# EAGLE schematic Mk3 Prototype (EAGLE 6.5.0)
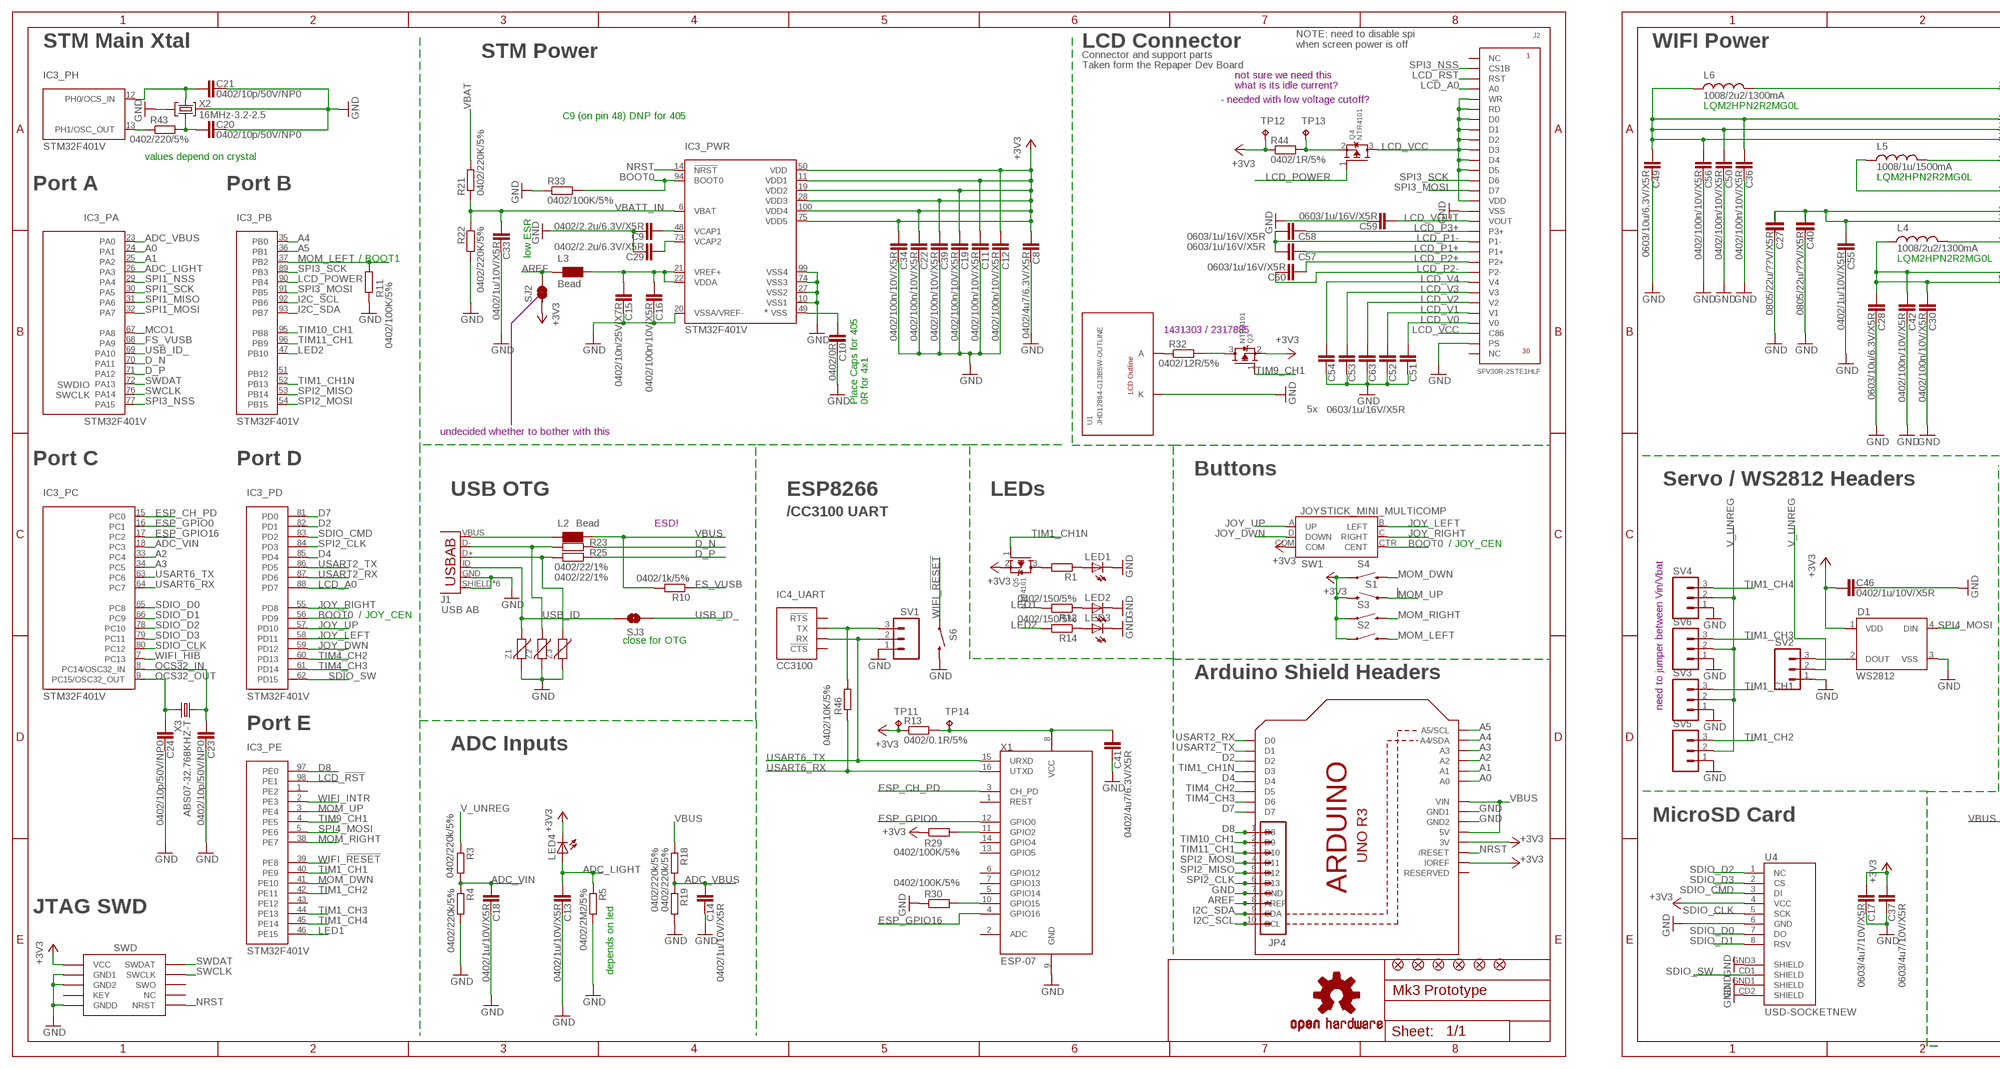
[diagram p0: schematic, sheet 1, part 1 of 2]
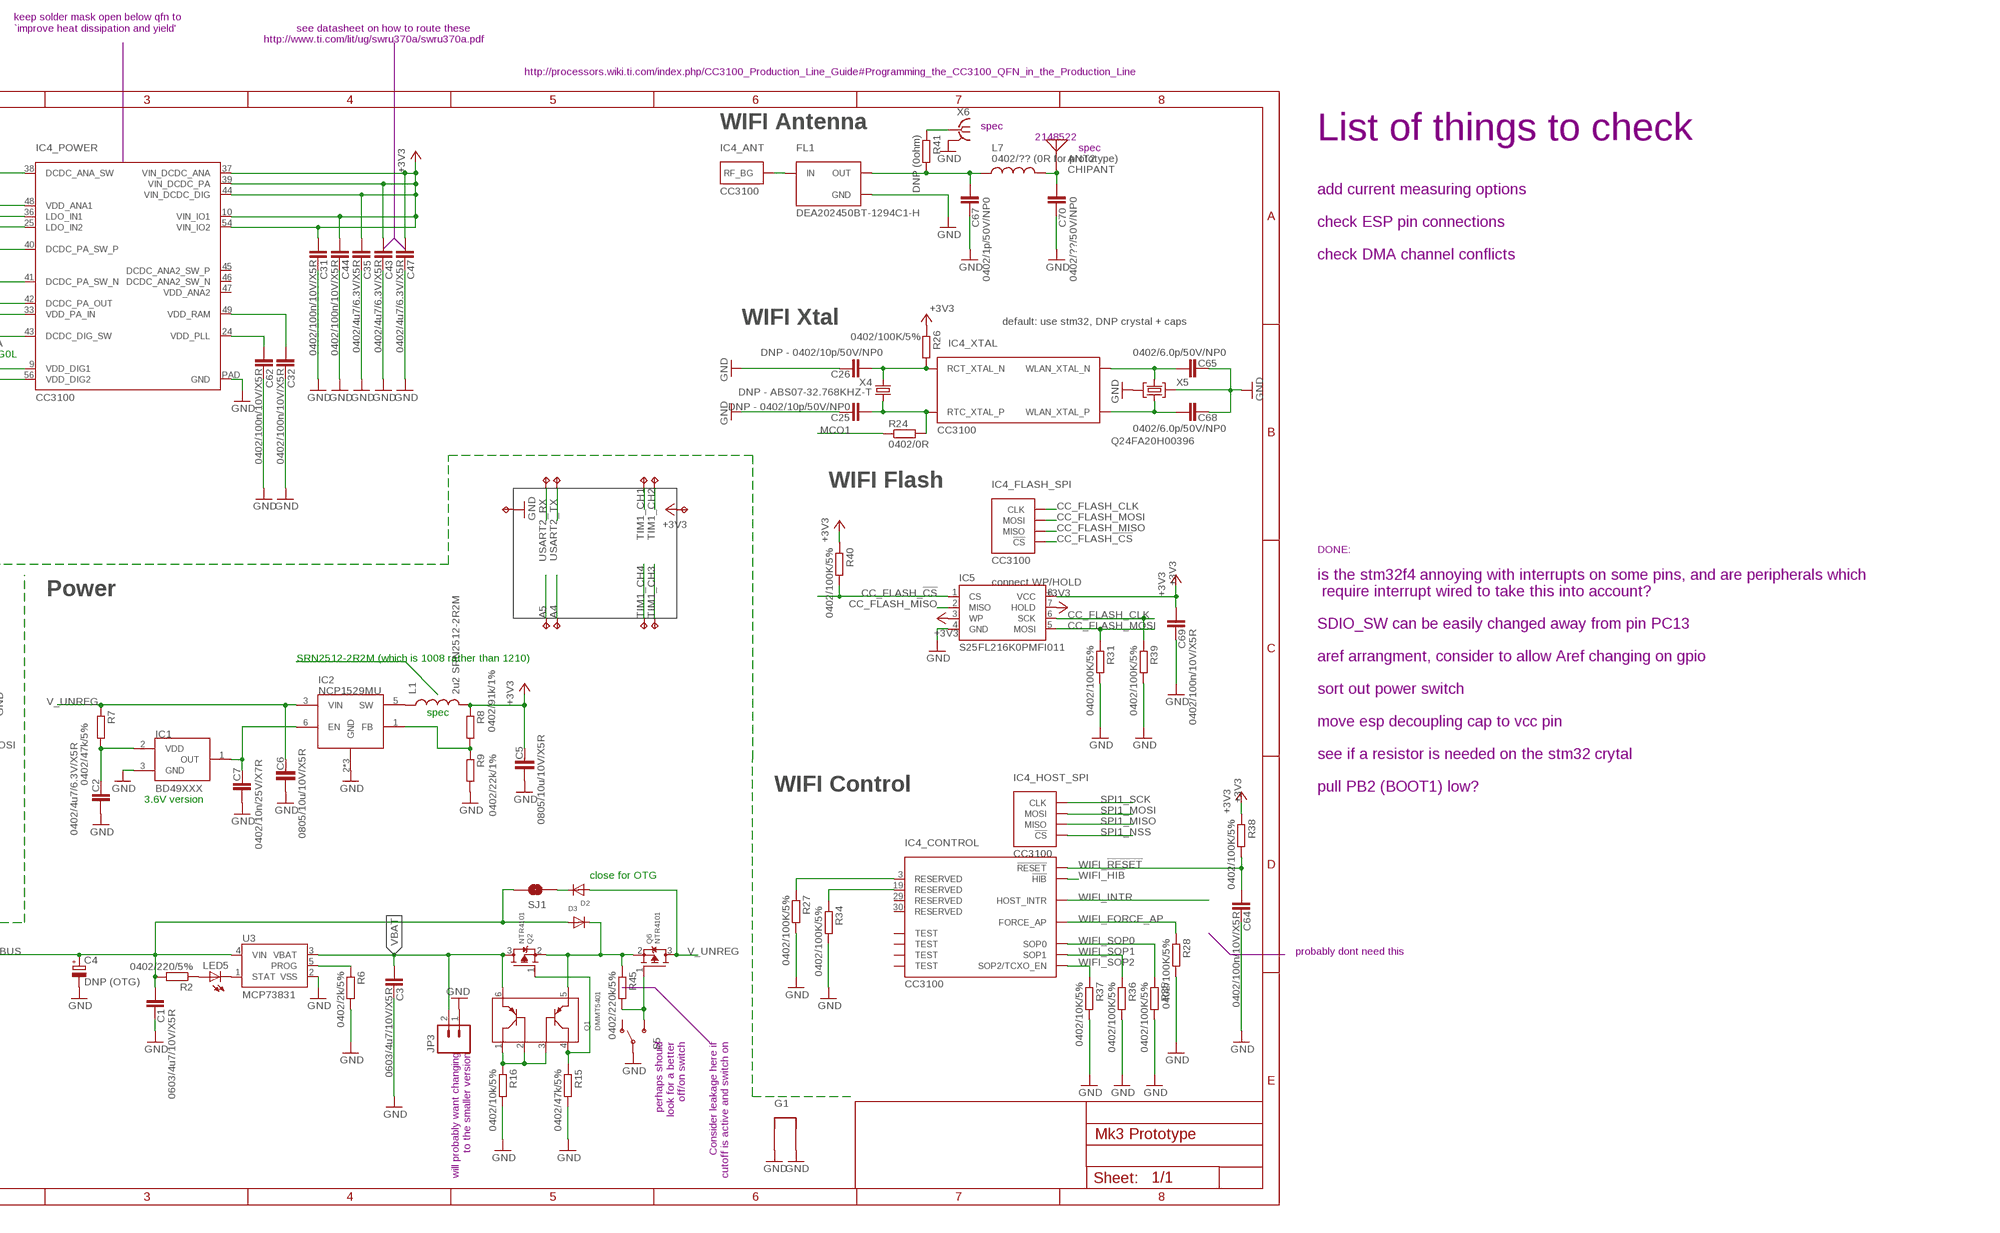
[diagram p1: schematic, sheet 1, part 2 of 2]

## Parts
ANT2  CHIPANT  [2450AT42A100]
C1  0603/4u7/10V/X5R  C-EUC0805K  [C0805K]
C2  0402/4u7/6.3V/X5R  C-EUC0402-SMALLER  [C0402-SMALLER]
C3  0603/4u7/10V/X5R  C-EUC0603K-SMALL  [C0603K-SMALL]
C4  DNP (OTG)  CPOL-EUE2.5-6  [E2,5-6]
C5  0805/10u/10V/X5R  CAPACITOR0805-N  [C0805-N]
C6  0805/10u/10V/X5R  CAPACITOR0805-N  [C0805-N]
C7  0402/10n/25V/X7R  C-EUC0402-SMALLER  [C0402-SMALLER]
C8  0402/4u7/6.3V/X5R  C-EUC0402-SMALLER  [C0402-SMALLER]
C9  0402/2.2u/6.3V/X5R  C-EUC0402-SMALLER  [C0402-SMALLER]
C10  0402/0R  C-EUC0402-SMALLER  [C0402-SMALLER]
C11  0402/100n/10V/X5R  C-EUC0402-SMALLER  [C0402-SMALLER]
C12  0402/100n/10V/X5R  C-EUC0402-SMALLER  [C0402-SMALLER]
C13  0402/1u/10V/X5R  C-EUC0402-SMALLER  [C0402-SMALLER]
C14  0402/1u/10V/X5R  C-EUC0402-SMALLER  [C0402-SMALLER]
C15  0402/10n/25V/X7R  C-EUC0402-SMALLER  [C0402-SMALLER]
C16  0402/100n/10V/X5R  C-EUC0402-SMALLER  [C0402-SMALLER]
C17  0603/4u7/10V/X5R  C-EUC0603K-SMALL  [C0603K-SMALL]
C18  0402/1u/10V/X5R  C-EUC0402-SMALLER  [C0402-SMALLER]
C19  0402/100n/10V/X5R  C-EUC0402-SMALLER  [C0402-SMALLER]
C20  0402/10p/50V/NP0  C-EUC0402-SMALLER  [C0402-SMALLER]
C21  0402/10p/50V/NP0  C-EUC0402-SMALLER  [C0402-SMALLER]
C22  0402/100n/10V/X5R  C-EUC0402-SMALLER  [C0402-SMALLER]
C23  0402/10p/50V/NP0  C-EUC0402-SMALLER  [C0402-SMALLER]
C24  0402/10p/50V/NP0  C-EUC0402-SMALLER  [C0402-SMALLER]
C25  DNP - 0402/10p/50V/NP0  C-EUC0402-SMALLER  [C0402-SMALLER]
C26  DNP - 0402/10p/50V/NP0  C-EUC0402-SMALLER  [C0402-SMALLER]
C27  0805/22u/??V/X5R  CAPACITOR0805-N  [C0805-N]
C28  0603/10u/6.3V/X5R  C-EUC0603K-SMALL  [C0603K-SMALL]
C29  0402/2.2u/6.3V/X5R  C-EUC0402-SMALLER  [C0402-SMALLER]
C30  0402/100n/10V/X5R  C-EUC0402-SMALLER  [C0402-SMALLER]
C31  0402/100n/10V/X5R  C-EUC0402-SMALLER  [C0402-SMALLER]
C32  0402/100n/10V/X5R  C-EUC0402-SMALLER  [C0402-SMALLER]
C33  0402/1u/10V/X5R  C-EUC0402-SMALLER  [C0402-SMALLER]
C34  0402/100n/10V/X5R  C-EUC0402-SMALLER  [C0402-SMALLER]
C35  0402/4u7/6.3V/X5R  C-EUC0402-SMALLER  [C0402-SMALLER]
C36  0402/100n/10V/X5R  C-EUC0402-SMALLER  [C0402-SMALLER]
C37  0603/4u7/10V/X5R  C-EUC0603K-SMALL  [C0603K-SMALL]
C39  0402/100n/10V/X5R  C-EUC0402-SMALLER  [C0402-SMALLER]
C40  0805/22u/??V/X5R  CAPACITOR0805-N  [C0805-N]
C41  0402/4u7/6.3V/X5R  C-EUC0402-SMALLER  [C0402-SMALLER]
C42  0402/100n/10V/X5R  C-EUC0402-SMALLER  [C0402-SMALLER]
C43  0402/4u7/6.3V/X5R  C-EUC0402-SMALLER  [C0402-SMALLER]
C44  0402/100n/10V/X5R  C-EUC0402-SMALLER  [C0402-SMALLER]
C46  0402/1u/10V/X5R  C-EUC0402-SMALLER  [C0402-SMALLER]
C47  0402/4u7/6.3V/X5R  C-EUC0402-SMALLER  [C0402-SMALLER]
C49  0603/10u/6.3V/X5R  C-EUC0603K-SMALL  [C0603K-SMALL]
C50  0402/100n/10V/X5R  C-EUC0402-SMALLER  [C0402-SMALLER]
C51  0603/1u/16V/X5R  C-EUC0603K-SMALL  [C0603K-SMALL]
C52  0603/1u/16V/X5R  C-EUC0603K-SMALL  [C0603K-SMALL]
C53  0603/1u/16V/X5R  C-EUC0603K-SMALL  [C0603K-SMALL]
C54  0603/1u/16V/X5R  C-EUC0603K-SMALL  [C0603K-SMALL]
C55  0402/1u/10V/X5R  C-EUC0402-SMALLER  [C0402-SMALLER]
C56  0402/100n/10V/X5R  C-EUC0402-SMALLER  [C0402-SMALLER]
C57  0603/1u/16V/X5R  C-EUC0603K-SMALL  [C0603K-SMALL]
C58  0603/1u/16V/X5R  C-EUC0603K-SMALL  [C0603K-SMALL]
C59  0603/1u/16V/X5R  C-EUC0603K-SMALL  [C0603K-SMALL]
C60  0603/1u/16V/X5R  C-EUC0603K-SMALL  [C0603K-SMALL]
C62  0402/100n/10V/X5R  C-EUC0402-SMALLER  [C0402-SMALLER]
C63  0603/1u/16V/X5R  C-EUC0603K-SMALL  [C0603K-SMALL]
C64  0402/100n/10V/X5R  C-EUC0402-SMALLER  [C0402-SMALLER]
C65  0402/6.0p/50V/NP0  C-EUC0402-SMALLER  [C0402-SMALLER]
C67  0402/1p/50V/NP0  C-EUC0402-SMALLER  [C0402-SMALLER]
C68  0402/6.0p/50V/NP0  C-EUC0402-SMALLER  [C0402-SMALLER]
C69  0402/100n/10V/X5R  C-EUC0402-SMALLER  [C0402-SMALLER]
C70  0402/??/50V/NP0  C-EUC0402-SMALLER  [C0402-SMALLER]
D1  WS2812B  [WS2812B]
D2  DIODESOD-323F  [SOD-323F]
D3  DIODESOD-323F  [SOD-323F]
FID1  FIDUCIAL1X2.5-STOP  [FIDUCIAL-1X2.5-STOP]
FID2  FIDUCIAL1X2.5-STOP  [FIDUCIAL-1X2.5-STOP]
FID3  FIDUCIAL1X2.5-STOP  [FIDUCIAL-1X2.5-STOP]
FID4  FIDUCIAL1X2.5-STOP  [FIDUCIAL-1X2.5-STOP]
FID5  FIDUCIAL1X2.5-STOP  [FIDUCIAL-1X2.5-STOP]
FID6  FIDUCIAL1X2.5-STOP  [FIDUCIAL-1X2.5-STOP]
FL1  DEA202450BT-1294C1-H  [DEA202450BT]
G1  GND-LOOP  [GND-LOOP]
IC1  BD49XXX  [SSOP5]
IC2  NCP1529MU  [DFN6]
IC3  STM32F401V  [TQFP100]
IC4  CC3100  [VQFN-64]
IC5  S25FL216K0PMFI011  SPI_FLASH-X25XXSMD1  [SO08-EIAJ]
J1  ZX62-AB-5PA(11)  USB-AB-LWK  [USB-AB-MICRO-SMD_LWK]
J2  SFV30R-2STE1HLF  JHD12863-G13BSW-CONNECTOR-SFV30R-2STE1HLF  [SFV30R-2STE1HLF]
J3  SWD_SHROUD  [SWD_PTH_SHROUD]
JP3  M02-JST-2MM-SMT  [JST-2-SMD]
JP4  M10NOSILK  [1X10-NOSILK]
L1  2u2 SRN2512-2R2M  INDUCTOR1210  [1210]
L2  Bead  WE-CBF_0805  [WUERTH-0805]
L3  Bead  WE-CBF_0805  [WUERTH-0805]
L4  1008/2u2/1300mA  INDUCTOR1008  [1008]
L5  1008/1u/1500mA  INDUCTOR1008  [1008]
L6  1008/2u2/1300mA  INDUCTOR1008  [1008]
L7  0402/?? (0R for prototype)  INDUCTOR-0402-NARROW  [L0402]
LED1  LED5MM  [LED5MM]
LED2  LED0603-CORRECT  [LED-0603-CORRECT]
LED3  LED0603-CORRECT  [LED-0603-CORRECT]
LED4  LED0603-CORRECT  [LED-0603-CORRECT]
LED5  LED0603-CORRECT  [LED-0603-CORRECT]
LOGO1  OSHW-LOGOM  [OSHW-LOGO-M]
Q1  DMMT5401  [SOT26]
Q2  NTR4101  MOSFET-P-SOT23  [SOT23-R]
Q3  NTR4101  MOSFET-P-SOT23  [SOT23-R]
Q4  NTR4101  MOSFET-P-SOT23  [SOT23-R]
Q5  NTR4101  MOSFET-P-SOT23  [SOT23-R]
Q6  NTR4101  MOSFET-P-SOT23  [SOT23-R]
R1  R-EU_0207/10  [0207/10]
R2  0402/220/5%  R-EU_R0402-SMALLER  [R0402-SMALLER]
R3  0402/220k/5%  R-EU_R0402-SMALLER  [R0402-SMALLER]
R4  0402/220k/5%  R-EU_R0402-SMALLER  [R0402-SMALLER]
R5  0402/2M2/5%  R-EU_R0402-SMALLER  [R0402-SMALLER]
R6  0402/2k/5%  R-EU_R0402-SMALLER  [R0402-SMALLER]
R7  0402/47k/5%  R-EU_R0402-SMALLER  [R0402-SMALLER]
R8  0402/91k/1%  R-EU_R0402-SMALLER  [R0402-SMALLER]
R9  0402/22k/1%  R-EU_R0402-SMALLER  [R0402-SMALLER]
R10  0402/1k/5%  R-EU_R0402-SMALLER  [R0402-SMALLER]
R11  0402/100K/5%  R-EU_R0402-SMALLER  [R0402-SMALLER]
R12  0402/150/5%  R-EU_R0402-SMALLER  [R0402-SMALLER]
R13  0402/0.1R/5%  R-EU_R0402-SMALLER  [R0402-SMALLER]
R14  0402/150/5%  R-EU_R0402-SMALLER  [R0402-SMALLER]
R15  0402/47k/5%  R-EU_R0402-SMALLER  [R0402-SMALLER]
R16  0402/10k/5%  R-EU_R0402-SMALLER  [R0402-SMALLER]
R18  0402/220k/5%  R-EU_R0402-SMALLER  [R0402-SMALLER]
R19  0402/220k/5%  R-EU_R0402-SMALLER  [R0402-SMALLER]
R21  0402/220K/5%  R-EU_R0402-SMALLER  [R0402-SMALLER]
R22  0402/220K/5%  R-EU_R0402-SMALLER  [R0402-SMALLER]
R23  0402/22/1%  R-EU_R0402-SMALLER  [R0402-SMALLER]
R24  0402/0R  R-EU_R0402-SMALLER  [R0402-SMALLER]
R25  0402/22/1%  R-EU_R0402-SMALLER  [R0402-SMALLER]
R26  0402/100K/5%  R-EU_R0402-SMALLER  [R0402-SMALLER]
R27  0402/100K/5%  R-EU_R0402-SMALLER  [R0402-SMALLER]
R28  0402/100K/5%  R-EU_R0402-SMALLER  [R0402-SMALLER]
R29  0402/100K/5%  R-EU_R0402-SMALLER  [R0402-SMALLER]
R30  0402/100K/5%  R-EU_R0402-SMALLER  [R0402-SMALLER]
R31  0402/100K/5%  R-EU_R0402-SMALLER  [R0402-SMALLER]
R32  0402/12R/5%  R-EU_R0402-SMALLER  [R0402-SMALLER]
R33  0402/100K/5%  R-EU_R0402-SMALLER  [R0402-SMALLER]
R34  0402/100K/5%  R-EU_R0402-SMALLER  [R0402-SMALLER]
R35  0402/100K/5%  R-EU_R0402-SMALLER  [R0402-SMALLER]
R36  0402/100K/5%  R-EU_R0402-SMALLER  [R0402-SMALLER]
R37  0402/10K/5%  R-EU_R0402-SMALLER  [R0402-SMALLER]
R38  0402/100K/5%  R-EU_R0402-SMALLER  [R0402-SMALLER]
R39  0402/100K/5%  R-EU_R0402-SMALLER  [R0402-SMALLER]
R40  0402/100K/5%  R-EU_R0402-SMALLER  [R0402-SMALLER]
R41  DNP (0ohm)  R-EU_R0402-SMALLER  [R0402-SMALLER]
R43  0402/220/5%  R-EU_R0402-SMALLER  [R0402-SMALLER]
R44  0402/1R/5%  R-EU_R0402-SMALLER  [R0402-SMALLER]
R45  0402/220k/5%  R-EU_R0402-SMALLER  [R0402-SMALLER]
R46  0402/10K/5%  R-EU_R0402-SMALLER  [R0402-SMALLER]
S1  SWITCH-MOMENTARY-2  [TACTILE_SWITCH_TALL]
S2  SWITCH-MOMENTARY-2  [TACTILE_SWITCH_TALL]
S3  SWITCH-MOMENTARY-2  [TACTILE_SWITCH_TALL]
S4  SWITCH-MOMENTARY-2  [TACTILE_SWITCH_TALL]
S5  SWITCH-SPST-SMD-A  [SWITCH-SPST-SMD-A]
S6  SWITCH-MOMENTARY-2SMD-1101NE  [TACTILE-SWITCH-1101NE]
SJ1  JUMPER-PAD-2-NOYES_SILK  [PAD-JUMPER-2-NO_YES_SILK]
SJ2  SOLDERJUMPERTRACE  [SJ_2S-TRACE]
SJ3  JUMPER-PAD-2-NOYES_SILK  [PAD-JUMPER-2-NO_YES_SILK]
SV1  M03PTH  [1X03]
SV2  M03PTH  [1X03]
SV3  M03PTH  [1X03]
SV4  M03PTH  [1X03]
SV5  M03PTH  [1X03]
SV6  M03PTH  [1X03]
SW1  JOYSTICK_MINI_MULTICOMP  [JOYSTICK_MULTICOMP]
TP1  TP4MM  [4MMEDGE]
TP2  TP4MM  [4MMEDGE]
TP3  TP4MM  [4MMEDGE]
TP4  TP4MM  [4MMEDGE]
TP5  TP4MM  [4MMEDGE]
TP6  TP4MM  [4MMEDGE]
TP7  TP4MM  [4MMEDGE]
TP8  TP4MM  [4MMEDGE]
TP9  TP4MM  [4MMEDGE]
TP10  TP4MM  [4MMEDGE]
TP11  TPB1,27  [B1,27]
TP12  TPB1,27  [B1,27]
TP13  TPB1,27  [B1,27]
TP14  TPB1,27  [B1,27]
U1  JHD12864-G13BSW-OUTLINE  [JHD12864-G13BSW-OUTLINE]
U2  ARDUINOR3-NODIM  [ARDUINOR3-NODIM]
U3  MCP73831  [SOT23-5]
U4  USD-SOCKETNEW  [MICRO-SD-SOCKET-PP]
X1  ESP-07  [ESP-07]
X2  16MHz-3.2-2.5  CRYSTAL-3.2-2.5  [CRYSTAL-3.2-2.5]
X3  ABS07-32.768KHZ-T  RESONATOR_EPSON_FC_145  [RESONATOR_EPSON_FC_145]
X4  DNP - ABS07-32.768KHZ-T  RESONATOR_EPSON_FC_145  [RESONATOR_EPSON_FC_145]
X5  Q24FA20H00396  CRYSTAL-2.5X2.0  [CRYSTAL-2.5X2.0]
X6  MC-921  [MC-921]
Z1  VARISTORCN0603  [CT/CN0603]
Z2  VARISTORCN0603  [CT/CN0603]
Z3  VARISTORCN0603  [CT/CN0603]

## Nets
+3V3: C5.1 C8.2 C11.2 C12.2 C17.2 C19.2 C22.2 C31.2 C34.2 C35.2 C37.2 C39.2 C43.2 C44.2 C46.2 C47.2 C69.2 D1.1(VDD) IC3.11(_PWR:VDD1) IC3.19(_PWR:VDD2) IC3.28(_PWR:VDD3) IC3.50(_PWR:VDD) IC3.75(_PWR:VDD5) IC3.100(_PWR:VDD4) IC4.10(_POWER:VIN_IO1) IC4.37(_POWER:VIN_DCDC_ANA) IC4.39(_POWER:VIN_DCDC_PA) IC4.44(_POWER:VIN_DCDC_DIG) IC4.54(_POWER:VIN_IO2) IC5.3(WP) IC5.7(HOLD) IC5.8(VCC) J3.1(VCC) L1.2 LED4.C Q3.2(S) Q5.2(S) R8.1 R13.1 R26.1 R29.1 R38.1 R40.1 R44.1 S1.B2 S2.A2 S3.A2 S4.A2 SJ2.1 SW1.COM TP6.P$1(TP) TP11.TP TP12.TP U2.3V U2.IOREF U4.4(VCC)
A0: IC3.24(_PA:PA1) U2.A0
A1: IC3.25(_PA:PA2) U2.A1
A2: IC3.33(_PC:PC4) U2.A2
A3: IC3.34(_PC:PC5) U2.A3
A4: IC3.35(_PB:PB0) TP8.P$1(TP) U2.A4(A4/SDA)
A5: IC3.36(_PB:PB1) TP7.P$1(TP) U2.A5(A5/SCL)
ADC_LIGHT: C13.2 IC3.26(_PA:PA3) LED4.A R5.1
ADC_VBUS: C14.2 IC3.23(_PA:PA0) R18.2 R19.1
ADC_VIN: C18.2 IC3.18(_PC:PC3) R3.2 R4.1
ANT [ANT]: ANT2.P$1 C70.1 L7.2
AREF: JP4.8 L3.1 SJ2.2 U2.AREF
BOOT0: IC3.56(_PD:PD9) IC3.94(_PWR:BOOT0) R33.2 SW1.CTR(CENT)
CC_FLASH_!CS: IC4.14(_FLASH_SPI:!CS) IC5.1(CS) R40.2
CC_FLASH_CLK: IC4.11(_FLASH_SPI:CLK) IC5.6(SCK) R39.1
CC_FLASH_MISO: IC4.13(_FLASH_SPI:MISO) IC5.2(MISO)
CC_FLASH_MOSI: IC4.12(_FLASH_SPI:MOSI) IC5.5(MOSI) R31.1
CHARGING: LED5.C U3.1(STAT)
D2: IC3.82(_PD:PD1) U2.D2
D4: IC3.85(_PD:PD4) U2.D4
D7: IC3.81(_PD:PD0) U2.D7
D8: IC3.97(_PE:PE0) JP4.1 U2.D8
D_N: IC3.70(_PA:PA11) R23.1
D_P: IC3.71(_PA:PA12) R25.1
DFGFDG: C15.2 C16.2 IC3.21(_PWR:VREF+) IC3.22(_PWR:VDDA) L3.2
ESP_CH_PD: IC3.15(_PC:PC0) X1.3(CH_PD)
ESP_GPIO0: IC3.16(_PC:PC1) X1.12(GPIO0)
ESP_GPIO16: IC3.17(_PC:PC2) X1.4(GPIO16)
FS_VUSB: IC3.68(_PA:PA9) R10.1
GND: C1.1 C2.2 C3.1 C4.- C5.2 C6.2 C7.2 C8.1 C9.1 C10.1 C11.1 C12.1 C13.1 C14.1 C15.1 C16.1 C17.1 C18.1 C19.1 C20.1 C21.1 C22.1 C23.1 C24.1 C25.1 C26.1 C27.1 C28.1 C29.1 C30.1 C31.1 C32.1 C33.1 C34.1 C35.1 C36.1 C37.1 C39.1 C40.1 C41.1 C42.1 C43.1 C44.1 C46.1 C47.1 C49.1 C50.1 C51.1 C52.1 C53.1 C54.1 C55.1 C56.1 C59.1 C62.1 C63.1 C64.1 C65.1 C67.2 C68.1 C69.1 C70.2 D1.3(VSS) FL1.GND@2(GND) FL1.GND@4(GND) G1.P$3 G1.P$4 IC1.3(GND) IC2.2(GND) IC2.4(GND) IC2.EP(GND) IC3.10(_PWR:VSS1) IC3.20(_PWR:VSSA/VREF-) IC3.27(_PWR:VSS2) IC3.74(_PWR:VSS3) IC3.99(_PWR:VSS4) IC4.PAD(_POWER:GND) IC5.4(GND) J1.GND J1.SHIELD J1.SHIELD@0(SHIELD) J1.SHIELD@1(SHIELD) J1.SHIELD@2(SHIELD) J1.SHIELD@3(SHIELD) J1.SHIELD@5(SHIELD) J2.16(VSS) J2.29(PS) J2.M1(VSS) J2.M2(VSS) J3.3(GND1) J3.5(GND2) J3.9(GNDD) JP3.1 JP4.7 LED1.K(C) LED2.C LED3.C R4.2 R5.2 R6.2 R9.2 R11.1 R15.2 R16.2 R19.2 R22.2 R27.2 R28.2 R30.1 R31.2 R33.1 R34.2 R35.2 R36.2 R37.2 R39.2 S5.2(P) S6.2 SV1.1 SV2.1 SV3.1 SV4.1 SV5.1 SV6.1 TP5.P$1(TP) U1.K U2.GND U2.GND1 U2.GND2 U3.2(VSS) U4.6(GND) U4.CD2(SHIELD) U4.GND1(SHIELD) U4.GND3(SHIELD) X1.9(GND) X2.2(GND) X2.4(GND) X5.2(GND) X5.4(GND) X6.2@1(GND) X6.2@2(GND) Z1.2 Z2.2 Z3.2
I2C_SCL: IC3.92(_PB:PB6) JP4.10 U2.SCL
I2C_SDA: IC3.93(_PB:PB7) JP4.9 U2.SDA
JOY_DWN: IC3.59(_PD:PD12) SW1.D(DOWN)
JOY_LEFT: IC3.58(_PD:PD11) SW1.B(LEFT)
JOY_RIGHT: IC3.55(_PD:PD8) SW1.C(RIGHT)
JOY_UP: IC3.57(_PD:PD10) SW1.A(UP)
LCD_!RST: IC3.98(_PE:PE1) J2.3(RST)
LCD_A0: IC3.88(_PD:PD7) J2.4(A0)
LCD_P1+: C57.2 J2.20(P1+)
LCD_P1-: C57.1 C58.1 J2.19(P1-)
LCD_P2+: C60.2 J2.21(P2+)
LCD_P2-: C60.1 J2.22(P2-)
LCD_P3+: C58.2 J2.18(P3+)
LCD_POWER: IC3.90(_PB:PB4) Q4.1(G)
LCD_V0: C51.2 J2.27(V0)
LCD_V1: C52.2 J2.26(V1)
LCD_V2: C63.2 J2.25(V2)
LCD_V3: C53.2 J2.24(V3)
LCD_V4: C54.2 J2.23(V4)
LCD_VCC: J2.5(WR) J2.6(RD) J2.7(D0) J2.8(D1) J2.9(D2) J2.10(D3) J2.11(D4) J2.12(D5) J2.15(VDD) J2.28(C86) Q4.3(D)
LCD_VOUT: C59.2 J2.17(VOUT)
LED1: IC3.46(_PE:PE15) R12.2
LED2: IC3.47(_PB:PB10) R14.2
MCO1: IC3.67(_PA:PA8) R24.1
MOM_DWN: IC3.41(_PE:PE10) S4.B2
MOM_LEFT: IC3.37(_PB:PB2) R11.2 S2.B2
MOM_RIGHT: IC3.38(_PE:PE7) S3.B2
MOM_UP: IC3.3(_PE:PE4) S1.A2
N$1: R32.1 U1.A
N$2 [ANT]: C67.1 FL1.OUT L7.1 R41.2
N$3: FL1.IN IC4.31(_ANT:RF_BG)
N$4: C9.2 IC3.48(_PWR:VCAP1)
N$5: C26.2 IC4.52(_XTAL:RCT_XTAL_N) R26.2 X4.P$1
N$6: Q1.4(C2) Q2.1(G) R15.1
N$7: Q1.1(C1) Q1.2(B1) Q1.3(B2) R16.1
N$8: C65.2 IC4.22(_XTAL:WLAN_XTAL_N) X5.3(C2)
N$9: C68.2 IC4.23(_XTAL:WLAN_XTAL_P) X5.1(C1)
N$10: IC4.3(_CONTROL:RESERVED) R27.1
N$11: IC4.19(_CONTROL:RESERVED) R34.1
N$12: C7.1 IC1.1(OUT) IC2.6(EN)
N$13: IC2.1(FB) R8.2 R9.1
N$15: D3.C Q1.5(E2) Q2.2(S) Q6.2(S) R45.1
N$16: IC4.38(_POWER:DCDC_ANA_SW) L6.2
N$17: C27.2 C40.2 C55.2 IC4.33(_POWER:VDD_PA_IN) IC4.42(_POWER:DCDC_PA_OUT)
N$18: C36.2 C49.2 C50.2 C56.2 IC4.25(_POWER:LDO_IN2) IC4.36(_POWER:LDO_IN1) IC4.48(_POWER:VDD_ANA1) L6.1
N$19: IC4.43(_POWER:DCDC_DIG_SW) L4.2
N$20: C62.2 IC4.24(_POWER:VDD_PLL)
N$21: D1.2(DOUT) SV2.3
N$22: C28.2 C30.2 C42.2 IC4.9(_POWER:VDD_DIG1) IC4.56(_POWER:VDD_DIG2) L4.1
N$23: IC4.40(_POWER:DCDC_PA_SW_P) L5.2
N$24: IC4.41(_POWER:DCDC_PA_SW_N) L5.1
N$25: C32.2 IC4.49(_POWER:VDD_RAM)
N$26: IC2.5(SW) L1.1
N$27: J1.VBUS L2.1
N$28: D2.C SJ1.1
N$31: C21.2 IC3.12(_PH:PH0/OCS_IN) X2.3(C2)
N$32: C25.2 IC4.51(_XTAL:RTC_XTAL_P) R24.2 X4.P$2
N$33: C20.2 R43.2 X2.1(C1)
N$34: R6.1 U3.5(PROG)
N$35: LED5.A R2.1
N$37: C10.2 IC3.49(_PWR:VSS)
N$38: C29.2 IC3.73(_PWR:VCAP2)
N$39: R29.2 X1.11(GPIO2)
N$40: IC4.55(_UART:TX) R46.2 SV1.3
N$42: IC3.13(_PH:PH1/OSC_OUT) R43.1
N$44: R30.2 X1.10(GPIO15)
N$48 [ANT]: R41.1 X6.1
N$51: LED3.A R14.1
N$52: LED2.A R12.1
N$53: Q4.2(S) R44.2 TP13.TP
N$54: Q6.1(G) R45.2 S5.3(S)
N$56: C2.1 IC1.2(VDD) R7.2
N$57: Q3.3(D) R32.2
N$60: LED1.A R1.1
N$61: Q5.3(D) R1.2
NRST: IC3.14(_PWR:!NRST) J3.10(NRST) U2.RESET(/RESET)
OCS32_IN: C23.2 IC3.8(_PC:PC14/OSC32_IN) X3.P$1
OCS32_OUT: C24.2 IC3.9(_PC:PC15/OSC32_OUT) X3.P$2
SDIO_CLK: IC3.80(_PC:PC12) U4.5(SCK)
SDIO_CMD: IC3.83(_PD:PD2) U4.3(DI)
SDIO_D0: IC3.65(_PC:PC8) U4.7(DO)
SDIO_D1: IC3.66(_PC:PC9) U4.8(RSV)
SDIO_D2: IC3.78(_PC:PC10) U4.1(NC)
SDIO_D3: IC3.79(_PC:PC11) U4.2(CS)
SDIO_SW: IC3.62(_PD:PD15) U4.CD1(SHIELD)
SPI1_MISO: IC3.31(_PA:PA6) IC4.7(_HOST_SPI:MISO)
SPI1_MOSI: IC3.32(_PA:PA7) IC4.6(_HOST_SPI:MOSI)
SPI1_NSS: IC3.29(_PA:PA4) IC4.8(_HOST_SPI:!CS)
SPI1_SCK: IC3.30(_PA:PA5) IC4.5(_HOST_SPI:CLK)
SPI2_CLK: IC3.84(_PD:PD3) JP4.6 U2.D13
SPI2_MISO: IC3.53(_PB:PB14) JP4.5 U2.D12
SPI2_MOSI: IC3.54(_PB:PB15) JP4.4 U2.D11
SPI3_MOSI: IC3.91(_PB:PB5) J2.14(D7)
SPI3_NSS: IC3.77(_PA:PA15) J2.2(CS1B)
SPI3_SCK: IC3.89(_PB:PB3) J2.13(D6)
SPI4_MOSI: D1.4(DIN) IC3.5(_PE:PE6)
SWCLK: IC3.76(_PA:PA14) J3.4(SWCLK)
SWDAT: IC3.72(_PA:PA13) J3.2(SWDAT)
TIM1_CH1: IC3.40(_PE:PE9) SV3.3 TP3.P$1(TP)
TIM1_CH1N: IC3.52(_PB:PB13) Q5.1(G) U2.D3
TIM1_CH2: IC3.42(_PE:PE11) SV5.3 TP4.P$1(TP)
TIM1_CH3: IC3.44(_PE:PE13) SV6.3 TP10.P$1(TP)
TIM1_CH4: IC3.45(_PE:PE14) SV4.3 TP9.P$1(TP)
TIM4_CH2: IC3.60(_PD:PD13) U2.D5
TIM4_CH3: IC3.61(_PD:PD14) U2.D6
TIM9_CH1: IC3.4(_PE:PE5) Q3.1(G)
TIM10_CH1: IC3.95(_PB:PB8) JP4.2 U2.D9
TIM11_CH1: IC3.96(_PB:PB9) JP4.3 U2.D10
USART2_RX: IC3.87(_PD:PD6) TP1.P$1(TP) U2.D0
USART2_TX: IC3.86(_PD:PD5) TP2.P$1(TP) U2.D1
USART6_RX: IC3.64(_PC:PC7) R46.1 X1.16(UTXD)
USART6_TX: IC3.63(_PC:PC6) IC4.57(_UART:RX) SV1.2 X1.15(URXD)
USB_D_N [90R]: J1.D- R23.2 Z2.1
USB_D_P [90R]: J1.D+ R25.2 Z3.1
USB_ID: J1.ID(USBID) SJ3.2 Z1.1
USB_ID_: IC3.69(_PA:PA10) SJ3.1
V_UNREG: C6.1 D2.A IC2.3(VIN) Q6.3(D) R3.1 R7.1 SV2.2 SV3.2 SV4.2 SV5.2 SV6.2
VBAT: C3.2 JP3.2 Q1.6(E1) Q2.3(D) R21.2 U3.3(VBAT)
VBATT_IN: C33.2 IC3.6(_PWR:VBAT) R21.1 R22.1
VBUS: C1.2 C4.+ D3.A L2.2 R2.2 R10.2 R18.1 SJ1.2 U2.5V U2.VIN U3.4(VIN)
VCC: C41.2 R13.2 TP14.TP X1.8(VCC)
WIFI_!HIB: IC3.7(_PC:PC13) IC4.2(_CONTROL:!HIB)
WIFI_!RESET: C64.2 IC3.39(_PE:PE8) IC4.32(_CONTROL:!RESET) R38.2 S6.1
WIFI_FORCE_AP: IC4.4(_CONTROL:FORCE_AP) R28.1
WIFI_INTR: IC3.2(_PE:PE3) IC4.15(_CONTROL:HOST_INTR)
WIFI_SOP0: IC4.35(_CONTROL:SOP0) R35.1
WIFI_SOP1: IC4.34(_CONTROL:SOP1) R36.1
WIFI_SOP2: IC4.21(_CONTROL:SOP2/TCXO_EN) R37.1
Unconnected: IC3.1(_PE:PE2) IC3.43(_PE:PE12) IC3.51(_PB:PB12) IC4.29(_CONTROL:RESERVED) IC4.30(_CONTROL:RESERVED) IC4.45(_POWER:DCDC_ANA2_SW_P) IC4.46(_POWER:DCDC_ANA2_SW_N) IC4.47(_POWER:VDD_ANA2) IC4.50(_UART:!RTS) IC4.58(_CONTROL:TEST) IC4.59(_CONTROL:TEST) IC4.60(_CONTROL:TEST) IC4.61(_UART:!CTS) IC4.62(_CONTROL:TEST) J2.1(NC) J2.30(NC) J3.6(SWO) J3.7(KEY) J3.8(NC) S5.1(O) U2.RESERVED X1.1(REST) X1.2(ADC) X1.5(GPIO14) X1.6(GPIO12) X1.7(GPIO13) X1.13(GPIO5) X1.14(GPIO4)

## Notes on the sheet
- keep solder mask open below qfn to 
  `improve heat dissipation and yield'
- see datasheet on how to route these
- http://www.ti.com/lit/ug/swru370a/swru370a.pdf
- http://processors.wiki.ti.com/index.php/CC3100_Production_Line_Guide#Programming_the_CC3100_QFN_in_the_Production_Line
- STM Main Xtal | LCD Connector
- NOTE: need to disable spi
  when screen power is off
- WIFI Power | WIFI Antenna | spec
- STM Power | Connector and support parts | 2148522 | List of things to check
- Taken form the Repaper Dev Board | spec
- not sure we need this
- what is its idle current?
- - needed with low voltage cutoff?
- LQM2HPN2R2MG0L | add current measuring options
- C9 (on pin 48) DNP for 405
- check ESP pin connections
- values depend on crystal
- check DMA channel conflicts
- LQM2HPN2R2MG0L
- Port A | Port B
- WIFI Xtal | default: use stm32, DNP crystal + caps
- low ESR
- / BOOT1 | LQM2HPN2R2MG0L
- 1431303 / 2317885
- WIFI Flash
- Place Caps for 405
  0R for 4x1
- 5x
- undecided whether to bother with this
- DONE:
- Port C | Port D
- Buttons | connect WP/HOLD
- Servo / WS2812 Headers | Power
- is the stm32f4 annoying with interrupts on some pins, and are peripherals which
   require interrupt wired to take this into account?
- USB OTG | ESP8266 | LEDs
- /CC3100 UART | SDIO_SW can be easily changed away from pin PC13
- ESD!
- / JOY_CEN | SRN2512-2R2M (which is 1008 rather than 1210) | aref arrangment, consider to allow Aref changing on gpio
- sort out power switch
- spec
- move esp decoupling cap to vcc pin
- USB AB
- / JOY_CEN
- see if a resistor is needed on the stm32 crytal
- close for OTG
- WIFI Control | pull PB2 (BOOT1) low?
- Arduino Shield Headers | WS2812 | 3.6V version
- need to jumper between Vin/Vbat
- Port E
- ADC Inputs | close for OTG
- MicroSD Card | probably dont need this
- perhaps should
  look for a better
  off/on switch
- Consider leakage here if
  cutoff is active and switch on
- JTAG SWD
- will probably want changing
   to the smaller version
- depends on led

## Library data of the parts
ANT2 = TiLDA Mk3 Parts:CHIPANT
C1-C3 C7-C26 C28-C37 C39 C41-C44 C46 C47 C49-C60 C62-C65 C67-C70 = TiLDA Mk3 Parts:C-EU: CAPACITOR, European symbol
C4 = TiLDA Mk3 Parts:CPOL-EU: POLARIZED CAPACITOR, European symbol
C5 C6 C27 C40 = passives-7351:CAPACITOR
D1 = SparkFun-LED:WS2812B: WS2812B - Intelligent control LED integrated light source Technical Specifications: Power Supply Voltage (VDD): 3.5 to 5.3 V Input Voltage (VI): -0.5 to VDD+0.5 V Operating Junction Temperature (Topt): -25°C to +80°C Storage Temperature Range (Tstg): -55°C to +150°C
D2 D3 = TiLDA Mk3 Parts:DIODE: Diode SMADIODE - SMA Surface Mount Package 20V 1A Schottky Diode Digikey: 641-1014-6-ND DO-1N4148 - Through Hole Small Current Diode SOD-123 20V 1 A (.5mV Vf) Schottky Diode - Digikey: MBRX120TPMSCT-ND SOD-323 10V 570mA (.38mV Vf, 3ns) Schottky Diode - Digikey: ZLLS410CT-ND SOD-523 30V 30mA Schottky Diode (RB751S-40TE61) - Digikey: RB751S-40TE61CT-ND SOT23-R/W - SOT23 Package (R = Solder Paste/Reflow Ovens, W = Hand-Soldering) BAT54Film 40V 300mA - Digikey: 497-7162-1-ND
FID1-FID6 = TiLDA Mk3 Parts:FIDUCIAL: Fiducial Alignment Points Various fiducial points for machine vision alignment.
FL1 = TiLDA Mk3 Parts:DEA202450BT-1294C1-H
G1 = dtb:GND-LOOP
IC1 = TiLDA Mk3 Parts:BD49XXX
IC2 = TiLDA Mk3 Parts:NCP1529
IC3 = TiLDA Mk3 Parts:STM32F401V
IC4 = TiLDA Mk3 Parts:CC3100
IC5 = TiLDA Mk3 Parts:SPI_FLASH-X25XX: 8pin SPI Flash series x25xx. Works with devices like W25X32 and BR25L32
J1 = TiLDA Mk3 Parts:USB-AB: This is a USB AB connector that is compatible with USB OTG. i.e. this connector can serve as a host or device
J2 = TiLDA Mk3 Parts:JHD12863-G13BSW-CONNECTOR
J3 = dtb:SWD_SHROUD
JP3 = TiLDA Mk3 Parts:M02: Header 2 Standard 2-pin 0.1" header. Use with straight break away headers (SKU : PRT-00116), right angle break away headers (PRT-00553), swiss pins (PRT-00743), machine pins (PRT-00117), and female headers (PRT-00115). Molex polarized connector foot print use with SKU : PRT-08233 with associated crimp pins and housings.
JP4 = TiLDA Mk3 Parts:M10: Header 10 Standard 10-pin 0.1" header. Use with straight break away headers (SKU : PRT-00116), right angle break away headers (PRT-00553), swiss pins (PRT-00743), machine pins (PRT-00117), and female headers (PRT-00115).
L1 L4-L7 = TiLDA Mk3 Parts:INDUCTOR: Inductors Basic Inductor/Choke - 0603 and 1206. Footprints are not proven and vary greatly between part numbers.
L2 L3 = TiLDA Mk3 Parts:WE-CBF: SMD EMI Suppression Ferrite Beads - excellent anti-EMI properties - low DCR - impedances till 3000 ohms - rated current up to 6 A
LED1-LED5 = TiLDA Mk3 Parts:LED: LEDs Standard schematic elements and footprints for 5mm, 3mm, 1206, and 0603 sized LEDs. 5mm - Spark Fun Electronics SKU : COM-00529 (and others)
LOGO1 = TiLDA Mk3 Parts:OSHW-LOGO: Open Source Hardware Logo This logo indicates the piece of hardware it is found on incorporates a OSHW license and/or adheres to the definition of open source hardware found here: http://freedomdefined.org/OSHW
Q1 = TiLDA Mk3 Parts:DMMT5401
Q2-Q6 = TiLDA Mk3 Parts:MOSFET-P
R1-R16 R18 R19 R21-R41 R43-R46 = TiLDA Mk3 Parts:R-EU_: RESISTOR, European symbol
S1-S4 = Mine:SWITCH-MOMENTARY-2: Various NO switches- pushbuttons, reed, etc
S5 = TiLDA Mk3 Parts:SWITCH-SPST: SPST Switch Simple slide switch. Spark Fun Electronics SKU : COM-00102
S6 = SparkFun-Electromechanical:SWITCH-MOMENTARY-2: Various NO switches- pushbuttons, reed, etc; PROD_ID: SWCH-00815
SJ1 SJ3 = SparkFun-Passives:JUMPER-PAD-2-NO
SJ2 = TiLDA Mk3 Parts:SOLDERJUMPER: Solder Jumper Standard SMD solder jumper. Used to automate production. Two varients : Normally Open and Normally Closed are the same, but have different paste layers. NC will have a large amount of paste and should jumper during reflow.
SV1-SV6 = TiLDA Mk3 Parts:M03: Header 3 Standard 3-pin 0.1" header. Use with straight break away headers (SKU : PRT-00116), right angle break away headers (PRT-00553), swiss pins (PRT-00743), machine pins (PRT-00117), and female headers (PRT-00115). Molex polarized connector foot print use with SKU : PRT-08232 with associated crimp pins and housings.
SW1 = TiLDA Mk3 Parts:JOYSTICK_MINI
TP1-TP14 = TiLDA Mk3 Parts:TP: Test pad
U1 = TiLDA Mk3 Parts:JHD12864-G13BSW-OUTLINE
U2 = TiLDA Mk3 Parts:ARDUINOR3: This is a new object for the new Arduino R3 - with extra pins that you may want to use (such as IOref, and duplicated A4/A5
U3 = TiLDA Mk3 Parts:MCP73831: Microchip's MCP73831 Miniature single cell, fully integrated Li-Ion, Li-polymer charge management controller http://ww1.microchip.com/downloads/en/DeviceDoc/21984a.pdf
U4 = TiLDA Mk3 Parts:USD-SOCKET: microSD Socket Push-push type uSD socket. Schematic element and footprint production proven. Spark Fun Electronics SKU : PRT-00127. tDoc lines correctly indicate media card edge positions when inserting (unlocked, locked, depressed).
X1 = TiLDA Mk3 Parts:ESP-07
X2 X5 = TiLDA Mk3 Parts:CRYSTAL
X3 X4 = TiLDA Mk3 Parts:RESONATOR_EPSON_FC_145
X6 = con-coax:MC-921: COAX. MICROWAVE CONNECTOR O/D diam 2.1 Source: www.tycoelectronics.com .. Electronics .. ENG_CD_1775146_A2.pdf; OC_FARNELL: unknown; OC_NEWARK: unknown
Z1-Z3 = TiLDA Mk3 Parts:VARISTOR: VARISTOR

## Net classes
0 default: width 0.15 mm, drill 0.3 mm
1 ANT: width 1.27 mm, drill 0.4 mm, clearance 0.4 mm
2 90R: width 0.5 mm, drill 0.3 mm, clearance 0.7 mm to class 0, clearance 0.1 mm
3 100R: width 0.15 mm, drill 0.3 mm, clearance 0.6 mm to class 2, clearance 0.4 mm
4 5V0: width 0.406 mm, drill 0.3 mm, clearance 0.6 mm to class 2, clearance 0.6 mm to class 3
5 3V3: width 0.254 mm, drill 0.3 mm, clearance 0.6 mm to class 2, clearance 0.6 mm to class 3
6 1V8: width 0.254 mm, drill 0.3 mm, clearance 0.6 mm to class 2, clearance 0.6 mm to class 3
7 H5V0: width 0.254 mm, drill 0.3 mm, clearance 0.6 mm to class 2, clearance 0.6 mm to class 3
8 MAINS: clearance 4 mm to class 0, clearance 4 mm to class 1, clearance 4 mm to class 2, clearance 4 mm to class 3, clearance 4 mm to class 4, clearance 4 mm to class 5, clearance 4 mm to class 6, clearance 4 mm to class 7, clearance 4 mm